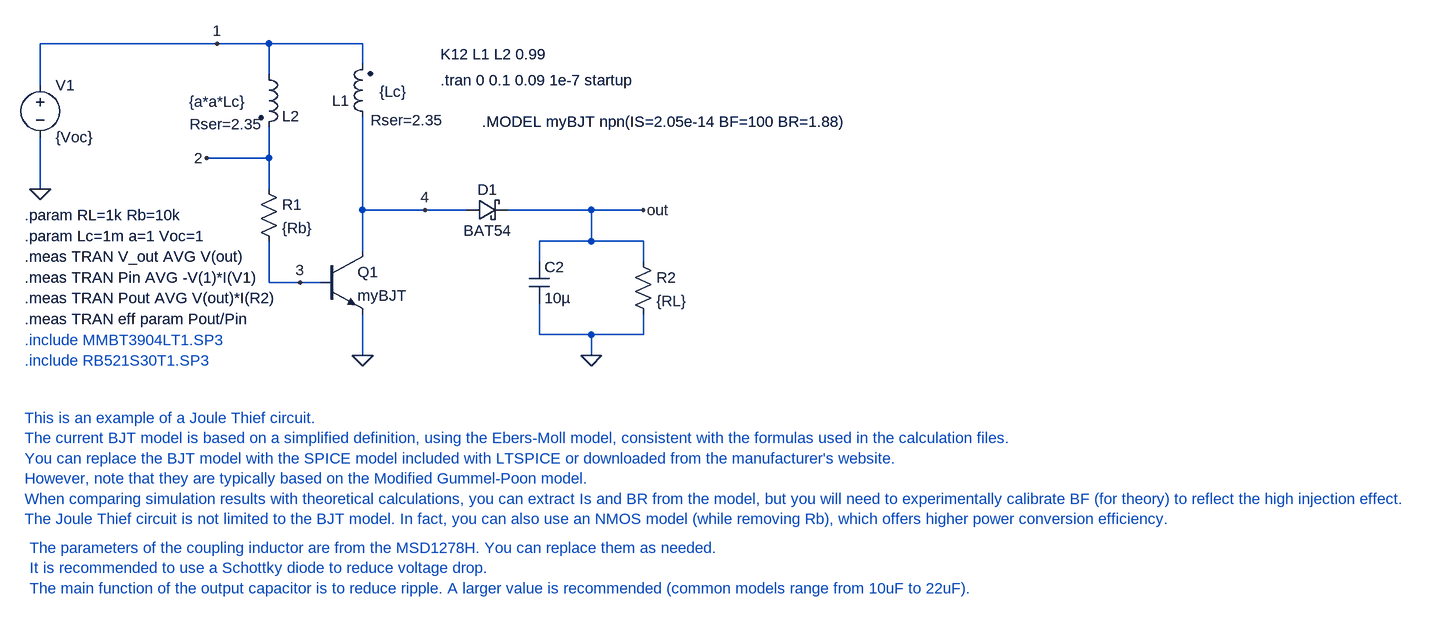
[diagram p0: schematic BJT_circuit.asc]
BJT_circuit.asc, the LTspice schematic file:
Version 4.1
SHEET 1 3820 1220
WIRE 368 64 96 64
WIRE 448 64 368 64
WIRE 592 64 448 64
WIRE 592 96 592 64
WIRE 448 112 448 64
WIRE 96 128 96 64
WIRE 448 240 448 192
WIRE 448 240 352 240
WIRE 96 288 96 208
WIRE 448 288 448 240
WIRE 592 320 592 176
WIRE 688 320 592 320
WIRE 752 320 688 320
WIRE 944 320 816 320
WIRE 1024 320 944 320
WIRE 944 368 944 320
WIRE 944 368 864 368
WIRE 1024 368 944 368
WIRE 592 384 592 320
WIRE 864 400 864 368
WIRE 1024 400 1024 368
WIRE 448 432 448 368
WIRE 496 432 448 432
WIRE 528 432 496 432
WIRE 864 512 864 464
WIRE 944 512 864 512
WIRE 1024 512 1024 480
WIRE 1024 512 944 512
WIRE 592 544 592 480
WIRE 944 544 944 512
FLAG 96 288 0
FLAG 592 544 0
FLAG 1024 320 out
FLAG 352 240 2
FLAG 944 544 0
FLAG 368 64 1
FLAG 688 320 4
FLAG 496 432 3
SYMBOL voltage 96 112 R0
WINDOW 123 0 0 Left 0
WINDOW 39 24 124 Left 2
SYMATTR InstName V1
SYMATTR Value {Voc}
SYMBOL ind2 432 96 R0
WINDOW 0 36 80 Left 2
WINDOW 3 -107 57 Left 2
WINDOW 39 -106 92 Left 2
SYMATTR InstName L2
SYMATTR Value {a*a*Lc}
SYMATTR SpiceLine Rser=2.35
SYMBOL ind2 608 192 R180
WINDOW 39 -109 10 Left 2
WINDOW 3 -52 54 Left 2
SYMATTR SpiceLine Rser=2.35
SYMATTR InstName L1
SYMATTR Value {Lc}
SYMBOL cap 848 400 R0
SYMATTR InstName C2
SYMATTR Value 10µ
SYMBOL res 432 272 R0
SYMATTR InstName R1
SYMATTR Value {Rb}
SYMBOL schottky 752 336 R270
WINDOW 0 32 32 VTop 2
WINDOW 3 0 32 VBottom 2
SYMATTR InstName D1
SYMATTR Value BAT54
SYMATTR Description Diode
SYMATTR Type diode
SYMBOL res 1008 384 R0
SYMATTR InstName R2
SYMATTR Value {RL}
SYMBOL npn 528 384 R0
SYMATTR InstName Q1
SYMATTR Value myBJT
TEXT 712 120 Left 2 !.tran 0 0.1 0.09 1e-7 startup
TEXT 712 80 Left 2 !K12 L1 L2 0.99
TEXT 72 328 Left 2 !.param RL=1k Rb=10k
TEXT 72 360 Left 2 !.param Lc=1m a=1 Voc=1
TEXT 72 520 Left 2 ;.include MMBT3904LT1.SP3
TEXT 72 424 Left 2 !.meas TRAN Pin AVG -V(1)*I(V1)
TEXT 72 456 Left 2 !.meas TRAN Pout AVG V(out)*I(R2)
TEXT 72 488 Left 2 !.meas TRAN eff param Pout/Pin
TEXT 72 392 Left 2 !.meas TRAN V_out AVG V(out)
TEXT 72 552 Left 2 ;.include RB521S30T1.SP3
TEXT 776 184 Left 2 !.MODEL myBJT npn(IS=2.05e-14 BF=100 BR=1.88)
TEXT 72 640 Left 2 ;This is an example of a Joule Thief circuit.\nThe current BJT model is based on a simplified definition, using the Ebers-Moll model, consistent with the formulas used in the calculation files.\nYou can replace the BJT model with the SPICE model included with LTSPICE or downloaded from the manufacturer's website.\nHowever, note that they are typically based on the Modified Gummel-Poon model. \nWhen comparing simulation results with theoretical calculations, you can extract Is and BR from the model, but you will need to experimentally calibrate BF (for theory) to reflect the high injection effect.\nThe Joule Thief circuit is not limited to the BJT model. In fact, you can also use an NMOS model (while removing Rb), which offers higher power conversion efficiency.
TEXT 80 840 Left 2 ;The parameters of the coupling inductor are from the MSD1278H. You can replace them as needed.\nIt is recommended to use a Schottky diode to reduce voltage drop.\nThe main function of the output capacitor is to reduce ripple. A larger value is recommended (common models range from 10uF to 22uF).

The netlist it stands for:
* BJT_circuit.asc
V1 1 0 {Voc}
L2 1 2 {a*a*Lc} Rser=2.35
L1 4 1 {Lc} Rser=2.35
C2 out 0 10µ
R1 2 3 {Rb}
D1 4 out BAT54
R2 out 0 {RL}
Q1 4 3 0 0 myBJT
.model D D
.lib standard.dio
.model NPN NPN
.model PNP PNP
.lib standard.bjt
.tran 0 0.1 0.09 1e-7 startup
K12 L1 L2 0.99
.param RL=1k Rb=10k
.param Lc=1m a=1 Voc=1
* .include MMBT3904LT1.SP3
.meas TRAN Pin AVG -V(1)*I(V1)
.meas TRAN Pout AVG V(out)*I(R2)
.meas TRAN eff param Pout/Pin
.meas TRAN V_out AVG V(out)
* .include RB521S30T1.SP3
.MODEL myBJT npn(IS=2.05e-14 BF=100 BR=1.88)
* This is an example of a Joule Thief circuit.
* The current BJT model is based on a simplified definition, using the Ebers-Moll model, consistent with the formulas used in the calculation files.
* You can replace the BJT model with the SPICE model included with LTSPICE or downloaded from the manufacturer's website.
* However, note that they are typically based on the Modified Gummel-Poon model.
* When comparing simulation results with theoretical calculations, you can extract Is and BR from the model, but you will need to experimentally calibrate BF (for theory) to reflect the high injection effect.
* The Joule Thief circuit is not limited to the BJT model. In fact, you can also use an NMOS model (while removing Rb), which offers higher power conversion efficiency.
* The parameters of the coupling inductor are from the MSD1278H. You can replace them as needed.
* It is recommended to use a Schottky diode to reduce voltage drop.
* The main function of the output capacitor is to reduce ripple. A larger value is recommended (common models range from 10uF to 22uF).
.backanno
.end